# Altium project APBoard.PrjPcb
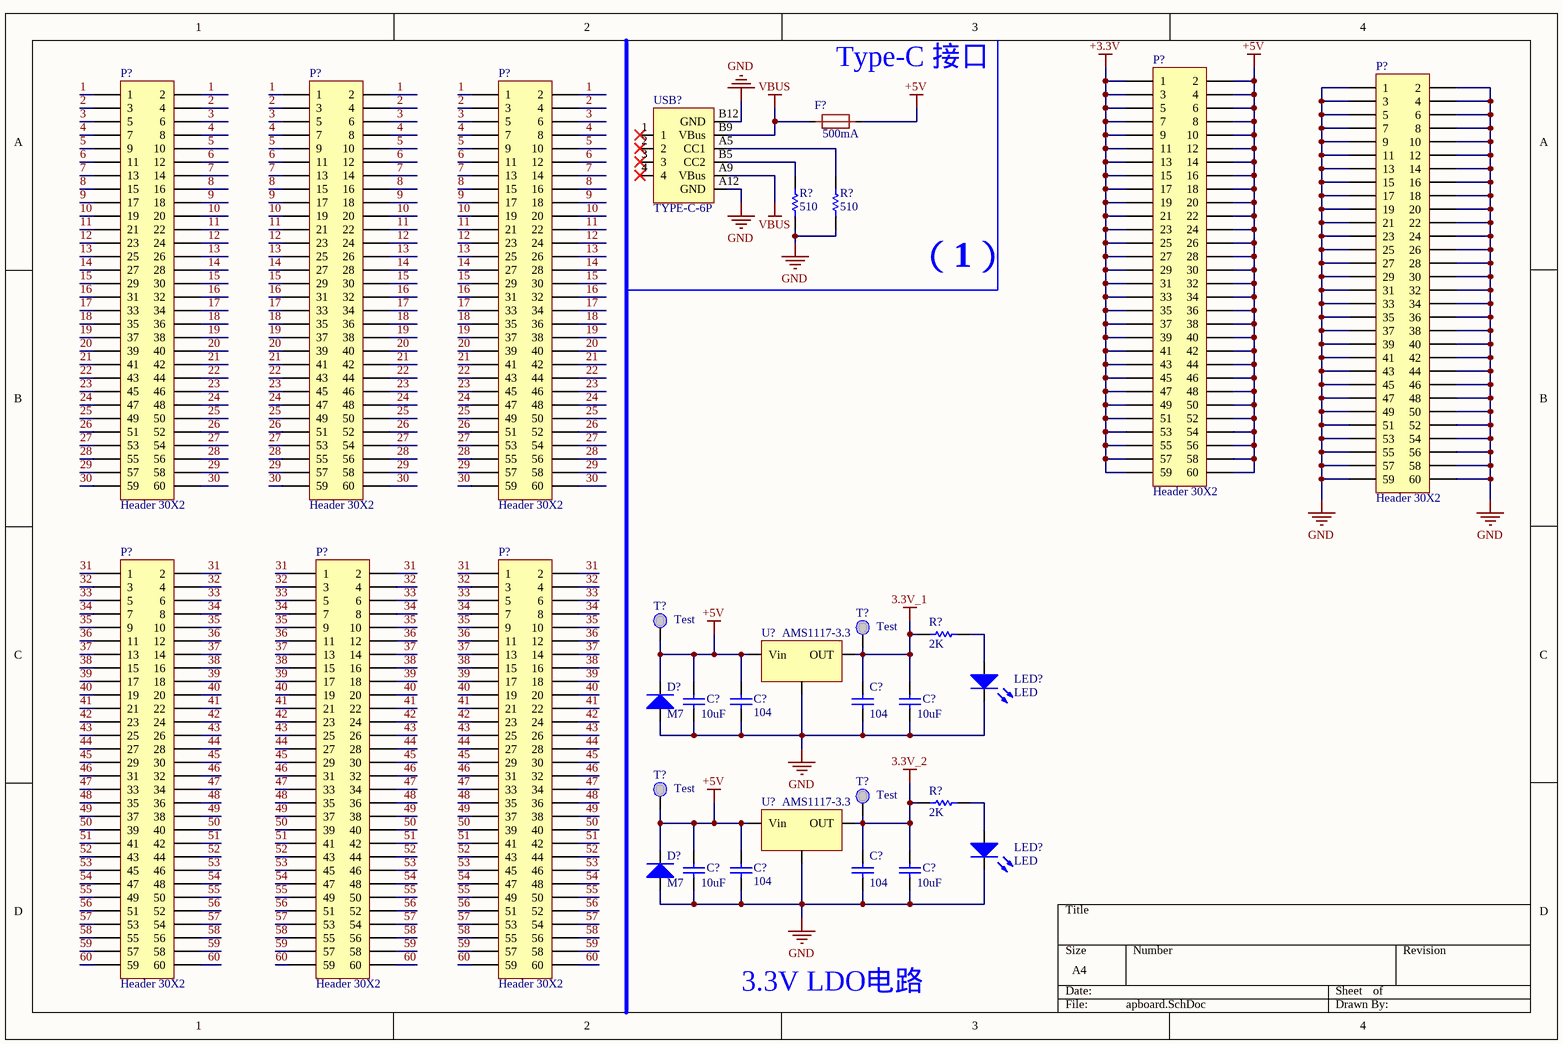
[diagram p0: apboard.SchDoc]
1 sheet, 32 parts. Net scope: global (net labels, ports and power ports of the same name join across sheets).

## Sheet apboard.SchDoc
size A4; SheetNumber: 1; SheetTotal: 1

### Parts
(Parts that share a designator on the sheet are numbered #1, #2 ... from top to bottom, then left to right.)
C?#1  value 10uF  [C1210]  (hidden comment: Cap)
C?#2  value 104  [C0603]  (hidden comment: Cap)
C?#3  value 104  [C0603]  (hidden comment: Cap)
C?#4  value 10uF  [C1210]  (hidden comment: Cap)
C?#5  value 10uF  [C1210]  (hidden comment: Cap)
C?#6  value 104  [C0603]  (hidden comment: Cap)
C?#7  value 104  [C0603]  (hidden comment: Cap)
C?#8  value 10uF  [C1210]  (hidden comment: Cap)
D?#1  M7  [SOD-123_L2.8-W1.8-LS3.7-RD]
D?#2  M7  [SOD-123_L2.8-W1.8-LS3.7-RD]
F?  500mA  [F0603]
LED?#1  LED  [LED0603_RED]
LED?#2  LED  [LED0603_RED]
P?#1  Header 30X2  [HDR2X30]
P?#2  Header 30X2  [HDR2X30]
P?#3  Header 30X2  [HDR2X30]
P?#4  Header 30X2  [HDR2X30]
P?#5  Header 30X2  [HDR2X30]
P?#6  Header 30X2  [HDR2X30]
P?#7  Header 30X2  [HDR2X30]
P?#8  Header 30X2  [HDR2X30]
R?#1  value 510  [R0603]  (hidden comment: Res)
R?#2  value 510  [R0603]  (hidden comment: Res)
R?#3  value 2K  [R0603]  (hidden comment: Res)
R?#4  value 2K  [R0603]  (hidden comment: Res)
T?#1  Test  [TEST-SMD]
T?#2  Test  [TEST-SMD]
T?#3  Test  [TEST-SMD]
T?#4  Test  [TEST-SMD]
U?#1  AMS1117-3.3  [SOT-223]
U?#2  AMS1117-3.3  [SOT-223]
USB?  TYPE-C-6P  [USB-C-SMD_6P]

### Nets
3.3V_1: C?#3.2 C?#4.2 R?#3.2 T?#2.1(TEST) U?#1.2(OUT)
3.3V_2: C?#7.2 C?#8.2 R?#4.2 T?#4.1(TEST) U?#2.2(OUT)
+3.3V: P?#1.1 P?#1.3 P?#1.5 P?#1.7 P?#1.9 P?#1.11 P?#1.13 P?#1.15 P?#1.17 P?#1.19 P?#1.21 P?#1.23 P?#1.25 P?#1.27 P?#1.29 P?#1.31 P?#1.33 P?#1.35 P?#1.37 P?#1.39 P?#1.41 P?#1.43 P?#1.45 P?#1.47 P?#1.49 P?#1.51 P?#1.53 P?#1.55 P?#1.57 P?#1.59
+5V: C?#1.2 C?#2.2 C?#5.2 C?#6.2 D?#1.1(K) D?#2.1(K) F?.2 P?#1.2 P?#1.4 P?#1.6 P?#1.8 P?#1.10 P?#1.12 P?#1.14 P?#1.16 P?#1.18 P?#1.20 P?#1.22 P?#1.24 P?#1.26 P?#1.28 P?#1.30 P?#1.32 P?#1.34 P?#1.36 P?#1.38 P?#1.40 P?#1.42 P?#1.44 P?#1.46 P?#1.48 P?#1.50 P?#1.52 P?#1.54 P?#1.56 P?#1.58 P?#1.60 T?#1.1(TEST) T?#3.1(TEST) U?#1.3(Vin) U?#2.3(Vin)
GND: C?#1.1 C?#2.1 C?#3.1 C?#4.1 C?#5.1 C?#6.1 C?#7.1 C?#8.1 D?#1.2(A) D?#2.2(A) LED?#1.2(K) LED?#2.2(K) P?#2.1 P?#2.2 P?#2.3 P?#2.4 P?#2.5 P?#2.6 P?#2.7 P?#2.8 P?#2.9 P?#2.10 P?#2.11 P?#2.12 P?#2.13 P?#2.14 P?#2.15 P?#2.16 P?#2.17 P?#2.18 P?#2.19 P?#2.20 P?#2.21 P?#2.22 P?#2.23 P?#2.24 P?#2.25 P?#2.26 P?#2.27 P?#2.28 P?#2.29 P?#2.30 P?#2.31 P?#2.32 P?#2.33 P?#2.34 P?#2.35 P?#2.36 P?#2.37 P?#2.38 P?#2.39 P?#2.40 P?#2.41 P?#2.42 P?#2.43 P?#2.44 P?#2.45 P?#2.46 P?#2.47 P?#2.48 P?#2.49 P?#2.50 P?#2.51 P?#2.52 P?#2.53 P?#2.54 P?#2.55 P?#2.56 P?#2.57 P?#2.58 P?#2.59 P?#2.60 R?#1.2 R?#2.2 U?#1.1(GND) U?#2.1(GND) USB?.A12(GND) USB?.B12(GND)
VBUS: F?.1 USB?.A9(VBus) USB?.B9(VBus)
1: P?#3.1 P?#3.2 P?#4.1 P?#4.2 P?#5.1 P?#5.2
2: P?#3.3 P?#3.4 P?#4.3 P?#4.4 P?#5.3 P?#5.4
3: P?#3.5 P?#3.6 P?#4.5 P?#4.6 P?#5.5 P?#5.6
4: P?#3.7 P?#3.8 P?#4.7 P?#4.8 P?#5.7 P?#5.8
5: P?#3.9 P?#3.10 P?#4.9 P?#4.10 P?#5.9 P?#5.10
6: P?#3.11 P?#3.12 P?#4.11 P?#4.12 P?#5.11 P?#5.12
7: P?#3.13 P?#3.14 P?#4.13 P?#4.14 P?#5.13 P?#5.14
8: P?#3.15 P?#3.16 P?#4.15 P?#4.16 P?#5.15 P?#5.16
9: P?#3.17 P?#3.18 P?#4.17 P?#4.18 P?#5.17 P?#5.18
10: P?#3.19 P?#3.20 P?#4.19 P?#4.20 P?#5.19 P?#5.20
11: P?#3.21 P?#3.22 P?#4.21 P?#4.22 P?#5.21 P?#5.22
12: P?#3.23 P?#3.24 P?#4.23 P?#4.24 P?#5.23 P?#5.24
13: P?#3.25 P?#3.26 P?#4.25 P?#4.26 P?#5.25 P?#5.26
14: P?#3.27 P?#3.28 P?#4.27 P?#4.28 P?#5.27 P?#5.28
15: P?#3.29 P?#3.30 P?#4.29 P?#4.30 P?#5.29 P?#5.30
16: P?#3.31 P?#3.32 P?#4.31 P?#4.32 P?#5.31 P?#5.32
17: P?#3.33 P?#3.34 P?#4.33 P?#4.34 P?#5.33 P?#5.34
18: P?#3.35 P?#3.36 P?#4.35 P?#4.36 P?#5.35 P?#5.36
19: P?#3.37 P?#3.38 P?#4.37 P?#4.38 P?#5.37 P?#5.38
20: P?#3.39 P?#3.40 P?#4.39 P?#4.40 P?#5.39 P?#5.40
21: P?#3.41 P?#3.42 P?#4.41 P?#4.42 P?#5.41 P?#5.42
22: P?#3.43 P?#3.44 P?#4.43 P?#4.44 P?#5.43 P?#5.44
23: P?#3.45 P?#3.46 P?#4.45 P?#4.46 P?#5.45 P?#5.46
24: P?#3.47 P?#3.48 P?#4.47 P?#4.48 P?#5.47 P?#5.48
25: P?#3.49 P?#3.50 P?#4.49 P?#4.50 P?#5.49 P?#5.50
26: P?#3.51 P?#3.52 P?#4.51 P?#4.52 P?#5.51 P?#5.52
27: P?#3.53 P?#3.54 P?#4.53 P?#4.54 P?#5.53 P?#5.54
28: P?#3.55 P?#3.56 P?#4.55 P?#4.56 P?#5.55 P?#5.56
29: P?#3.57 P?#3.58 P?#4.57 P?#4.58 P?#5.57 P?#5.58
30: P?#3.59 P?#3.60 P?#4.59 P?#4.60 P?#5.59 P?#5.60
31: P?#6.1 P?#6.2 P?#7.1 P?#7.2 P?#8.1 P?#8.2
32: P?#6.3 P?#6.4 P?#7.3 P?#7.4 P?#8.3 P?#8.4
33: P?#6.5 P?#6.6 P?#7.5 P?#7.6 P?#8.5 P?#8.6
34: P?#6.7 P?#6.8 P?#7.7 P?#7.8 P?#8.7 P?#8.8
35: P?#6.9 P?#6.10 P?#7.9 P?#7.10 P?#8.9 P?#8.10
36: P?#6.11 P?#6.12 P?#7.11 P?#7.12 P?#8.11 P?#8.12
37: P?#6.13 P?#6.14 P?#7.13 P?#7.14 P?#8.13 P?#8.14
38: P?#6.15 P?#6.16 P?#7.15 P?#7.16 P?#8.15 P?#8.16
39: P?#6.17 P?#6.18 P?#7.17 P?#7.18 P?#8.17 P?#8.18
40: P?#6.19 P?#6.20 P?#7.19 P?#7.20 P?#8.19 P?#8.20
41: P?#6.21 P?#6.22 P?#7.21 P?#7.22 P?#8.21 P?#8.22
42: P?#6.23 P?#6.24 P?#7.23 P?#7.24 P?#8.23 P?#8.24
43: P?#6.25 P?#6.26 P?#7.25 P?#7.26 P?#8.25 P?#8.26
44: P?#6.27 P?#6.28 P?#7.27 P?#7.28 P?#8.27 P?#8.28
45: P?#6.29 P?#6.30 P?#7.29 P?#7.30 P?#8.29 P?#8.30
46: P?#6.31 P?#6.32 P?#7.31 P?#7.32 P?#8.31 P?#8.32
47: P?#6.33 P?#6.34 P?#7.33 P?#7.34 P?#8.33 P?#8.34
48: P?#6.35 P?#6.36 P?#7.35 P?#7.36 P?#8.35 P?#8.36
49: P?#6.37 P?#6.38 P?#7.37 P?#7.38 P?#8.37 P?#8.38
50: P?#6.39 P?#6.40 P?#7.39 P?#7.40 P?#8.39 P?#8.40
51: P?#6.41 P?#6.42 P?#7.41 P?#7.42 P?#8.41 P?#8.42
52: P?#6.43 P?#6.44 P?#7.43 P?#7.44 P?#8.43 P?#8.44
53: P?#6.45 P?#6.46 P?#7.45 P?#7.46 P?#8.45 P?#8.46
54: P?#6.47 P?#6.48 P?#7.47 P?#7.48 P?#8.47 P?#8.48
55: P?#6.49 P?#6.50 P?#7.49 P?#7.50 P?#8.49 P?#8.50
56: P?#6.51 P?#6.52 P?#7.51 P?#7.52 P?#8.51 P?#8.52
57: P?#6.53 P?#6.54 P?#7.53 P?#7.54 P?#8.53 P?#8.54
58: P?#6.55 P?#6.56 P?#7.55 P?#7.56 P?#8.55 P?#8.56
59: P?#6.57 P?#6.58 P?#7.57 P?#7.58 P?#8.57 P?#8.58
60: P?#6.59 P?#6.60 P?#7.59 P?#7.60 P?#8.59 P?#8.60
NetLED?#1_1: LED?#1.1(A) R?#3.1
NetLED?#2_1: LED?#2.1(A) R?#4.1
NetR?#1_1: R?#1.1 USB?.B5(CC2)
NetR?#2_1: R?#2.1 USB?.A5(CC1)

Not connected (* = marked no-connect by the designer): USB? 1* 2* 3* 4*

### Notes on the sheet
- (near F?) Type-C 接口
- （1）
- 3.3V LDO电路

### Library data of the parts
C?#1-C?#8 = Cap: 无极性电容; Publisher: 信念D力量
D?#1 D?#2 = 1N4007: 1N4007 二极管
F? = Fuse 1: 保险丝 - Fuse
LED?#1 LED?#2 = LED: 发光二极管
P?#1-P?#8 = Header 30X2: Header, 30-Pin, Dual row; LatestRevisionDate: 17-Jul-2002; LatestRevisionNote: Re-released for DXP Platform.; Publisher: Altium Limited
R?#1-R?#4 = Res: 美国电阻符号; Published: 8-Jun-2000; LatestRevisionDate: 29-May-2009; LatestRevisionNote: IPC-7351 Footprint Added.; PackageReference: J1-0603; Publisher: Altium Limited; PackageDescription: Chip Resistor
U?#1 U?#2 = AMS1117-3.3: 线性稳压芯片 - Voltage Regulator
USB? = TYPE-C-6P: Type-C USB，6P